# Altium schematic sheet 0146_MTG HOLES AND LABE.SchDoc
size 848 x 558 mm
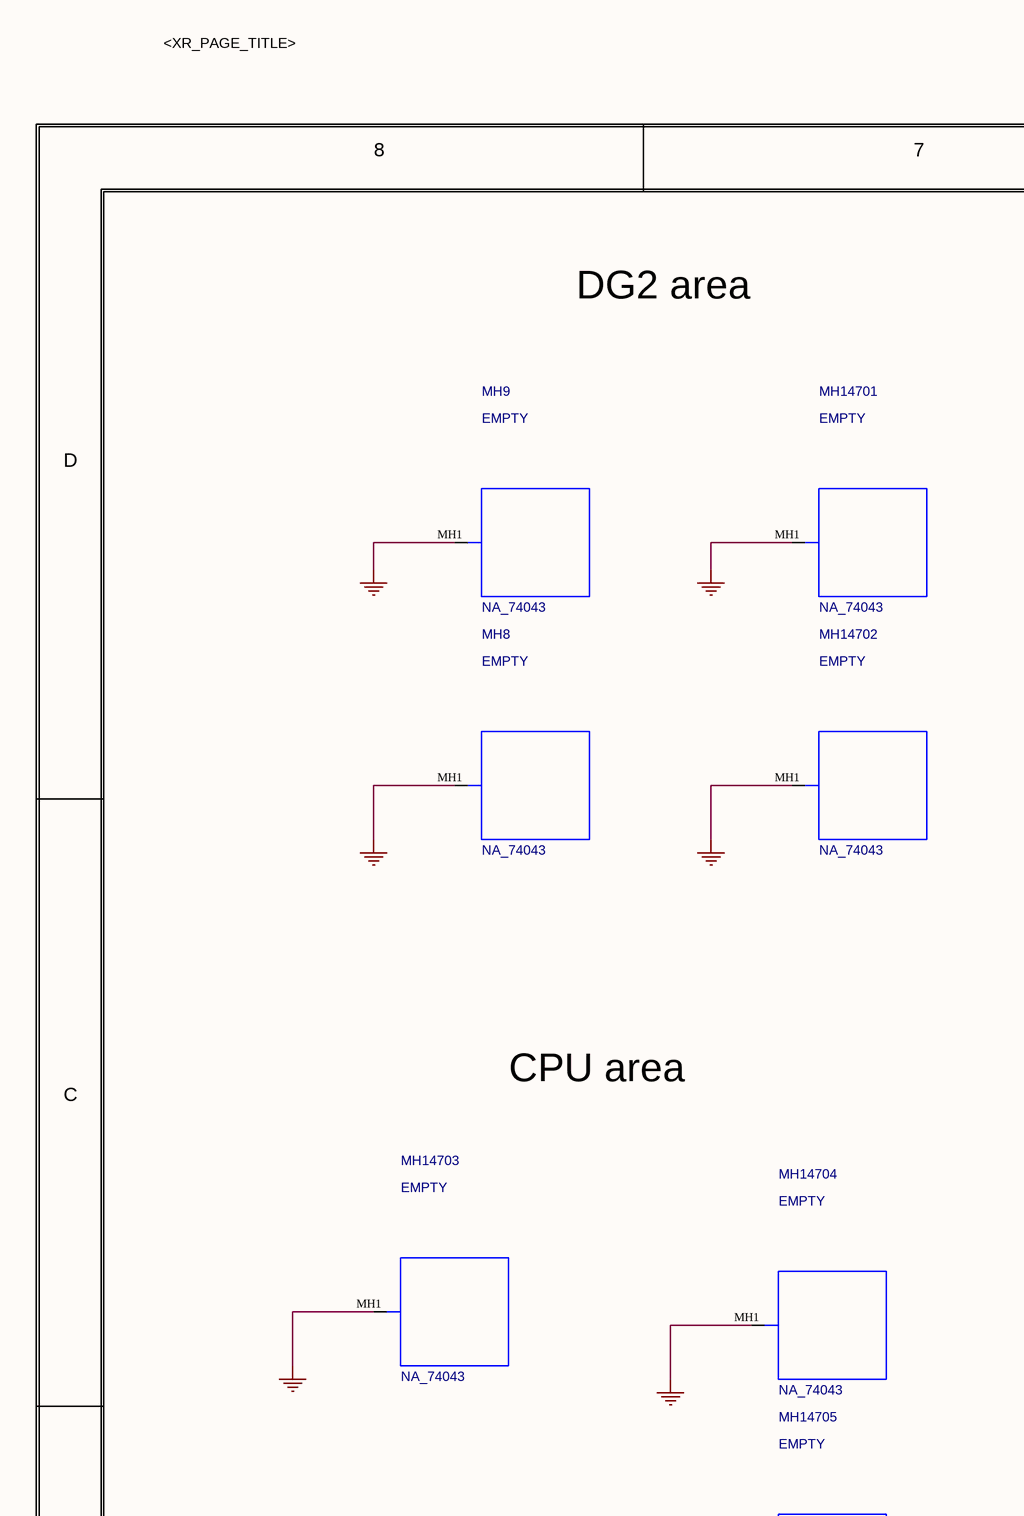
[diagram p0: 0146_MTG HOLES AND LABE.SchDoc, top left]
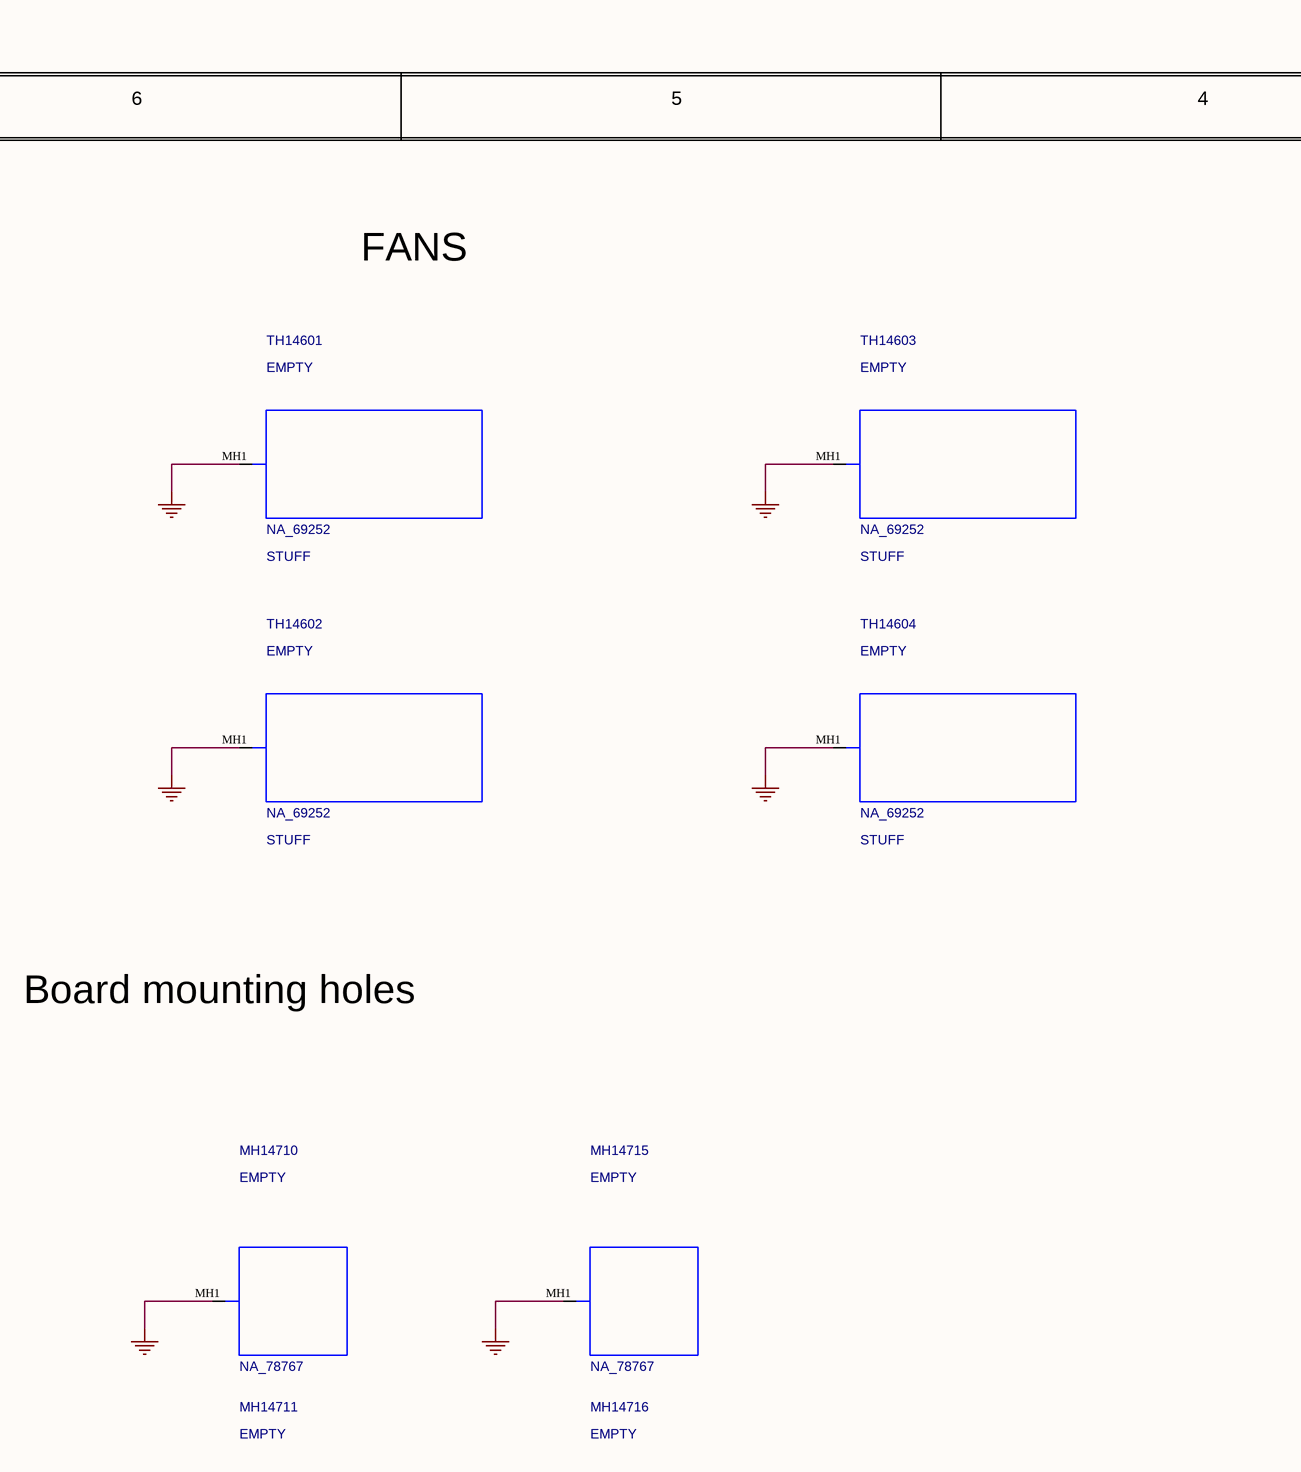
[diagram p1: 0146_MTG HOLES AND LABE.SchDoc, top middle]
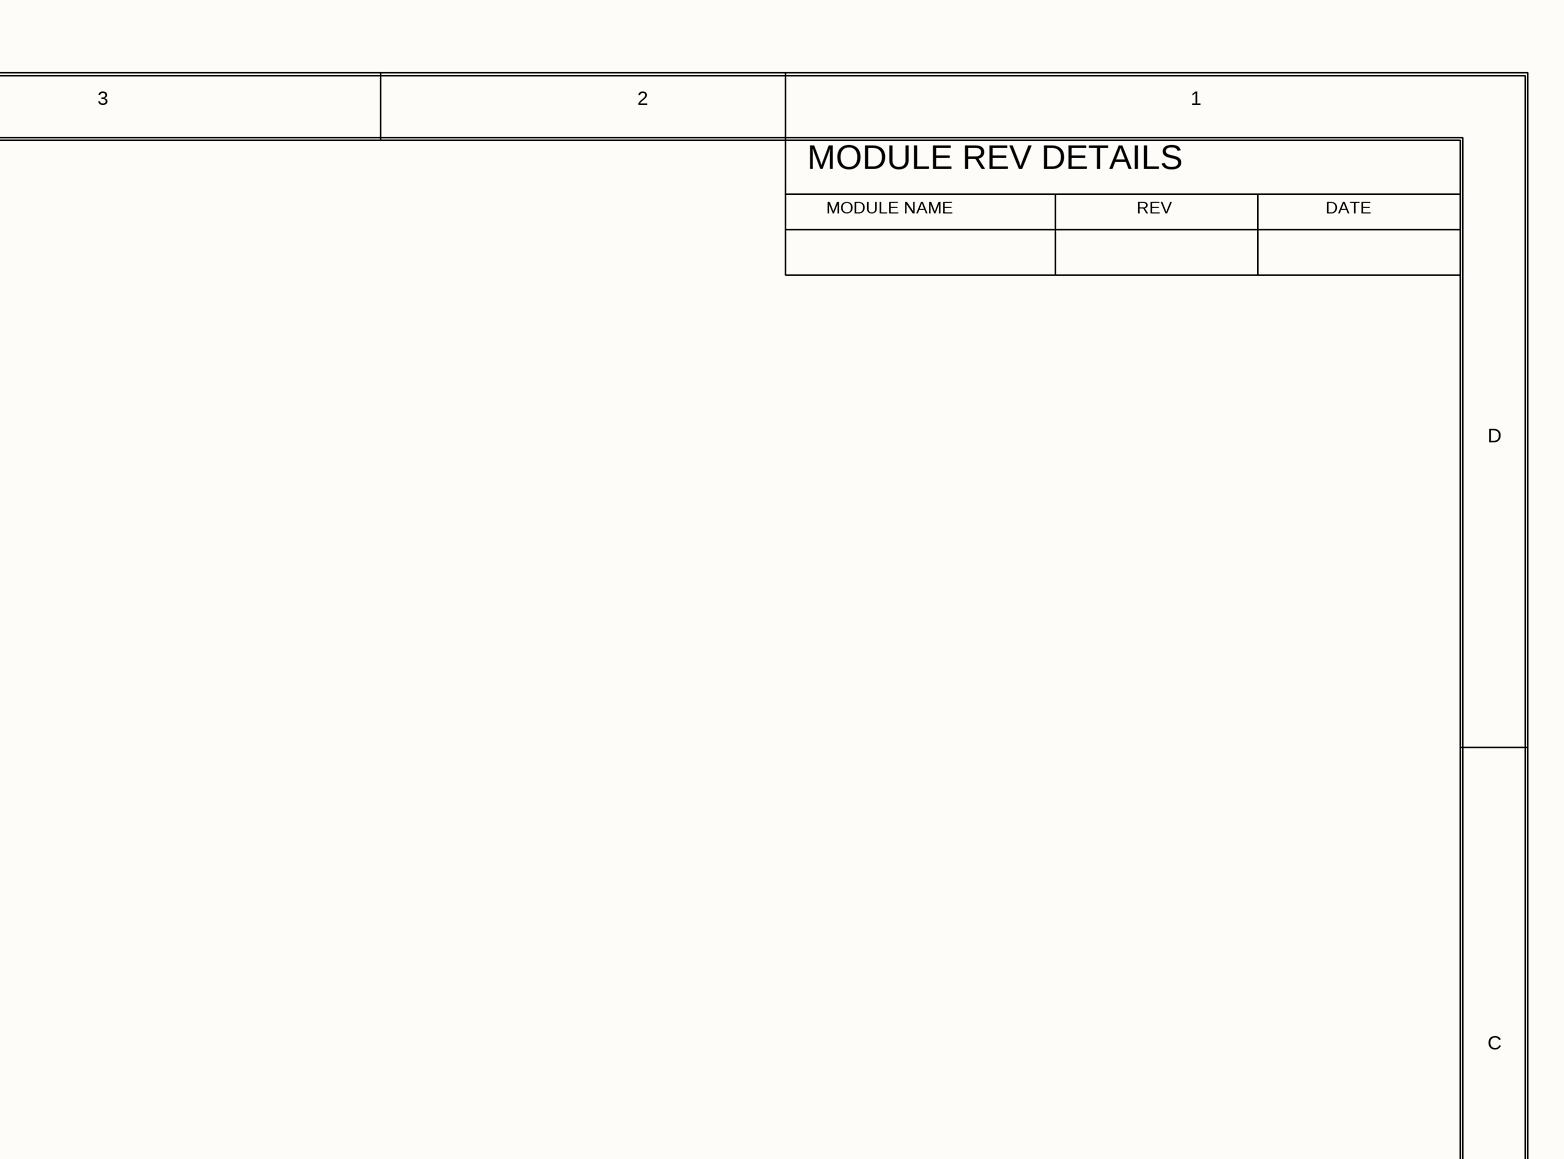
[diagram p2: 0146_MTG HOLES AND LABE.SchDoc, top right]
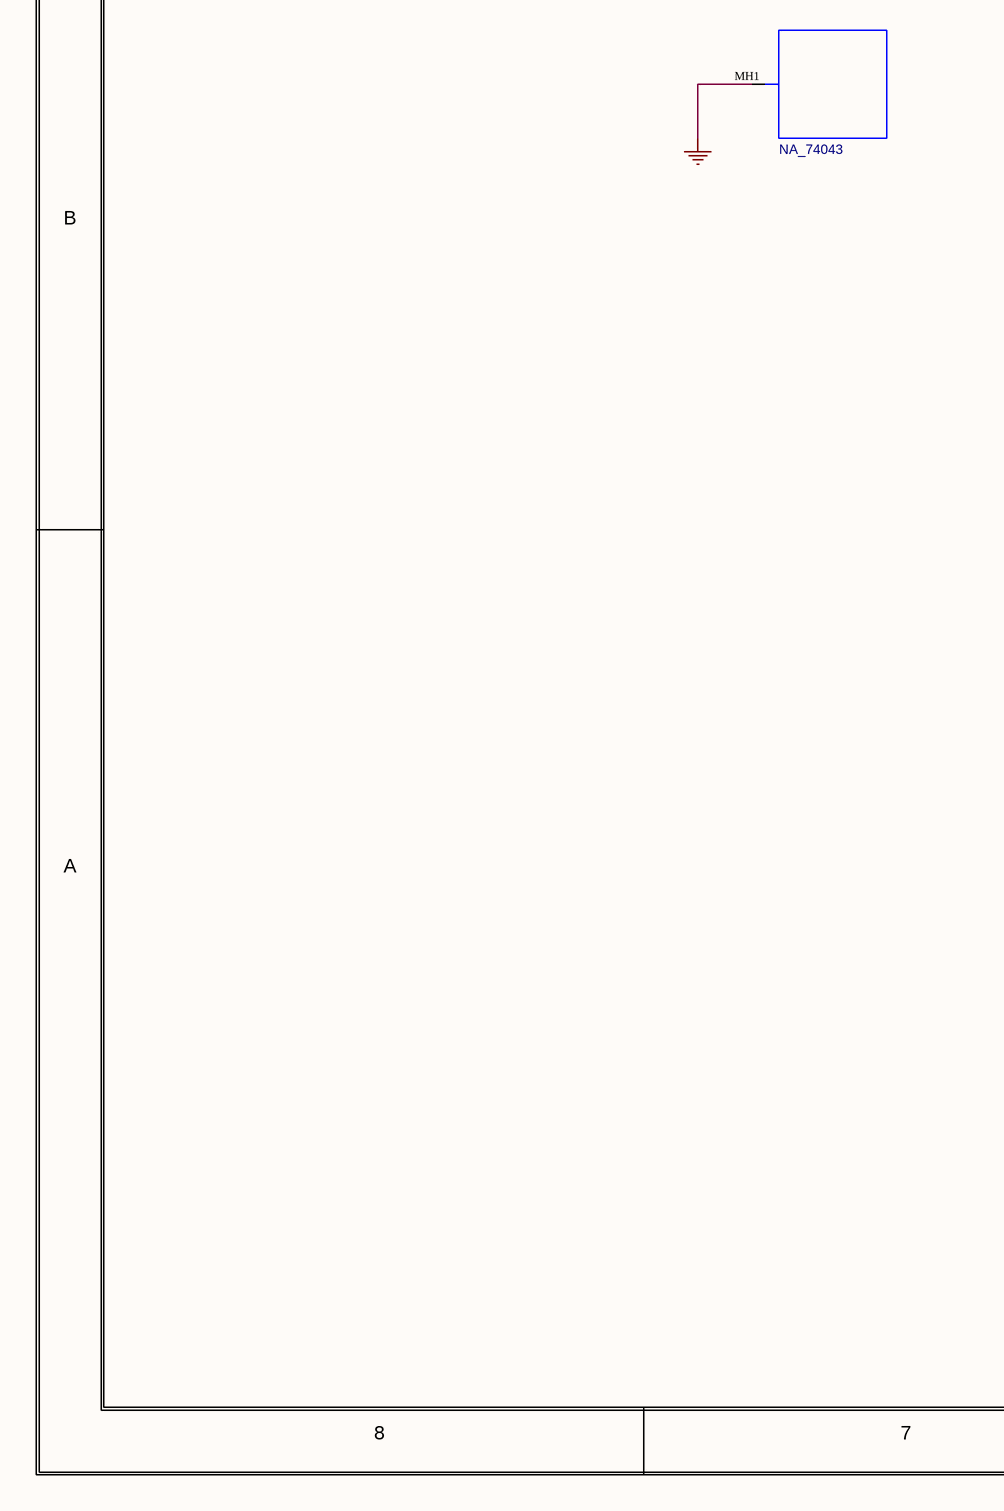
[diagram p3: 0146_MTG HOLES AND LABE.SchDoc, bottom left]
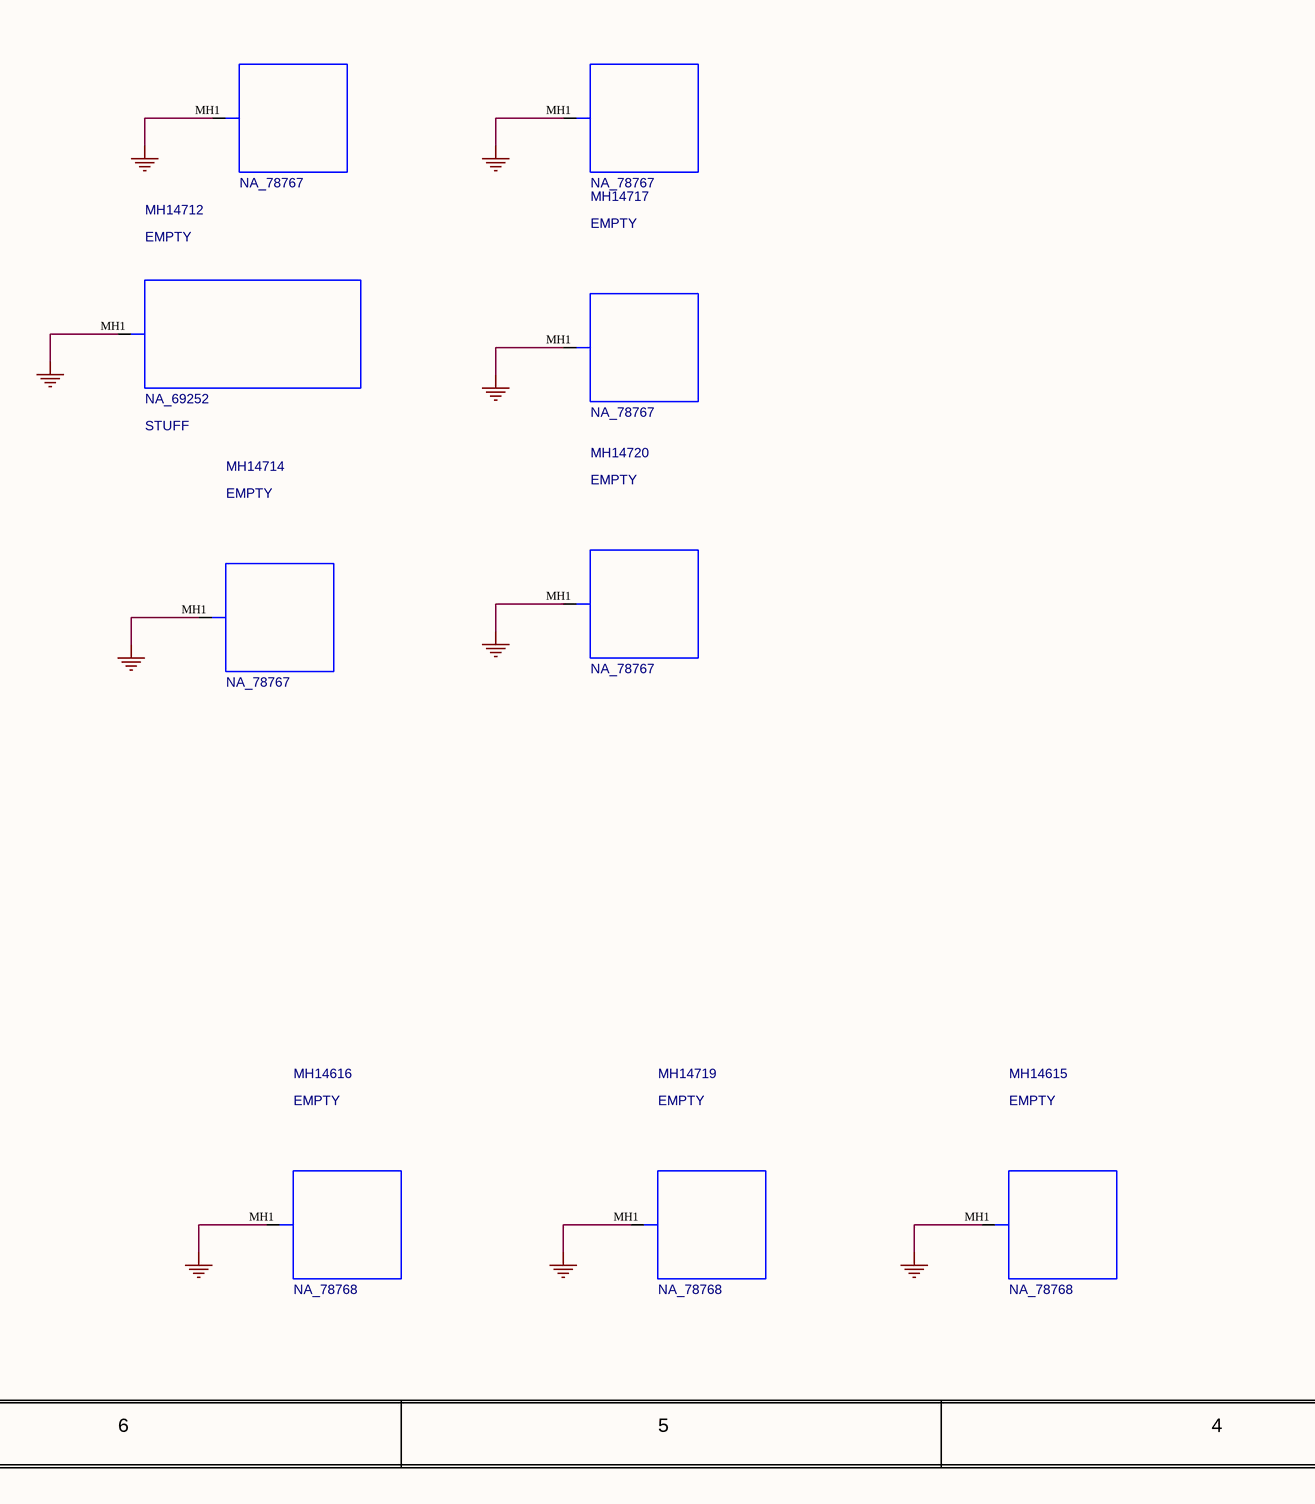
[diagram p4: 0146_MTG HOLES AND LABE.SchDoc, bottom middle]
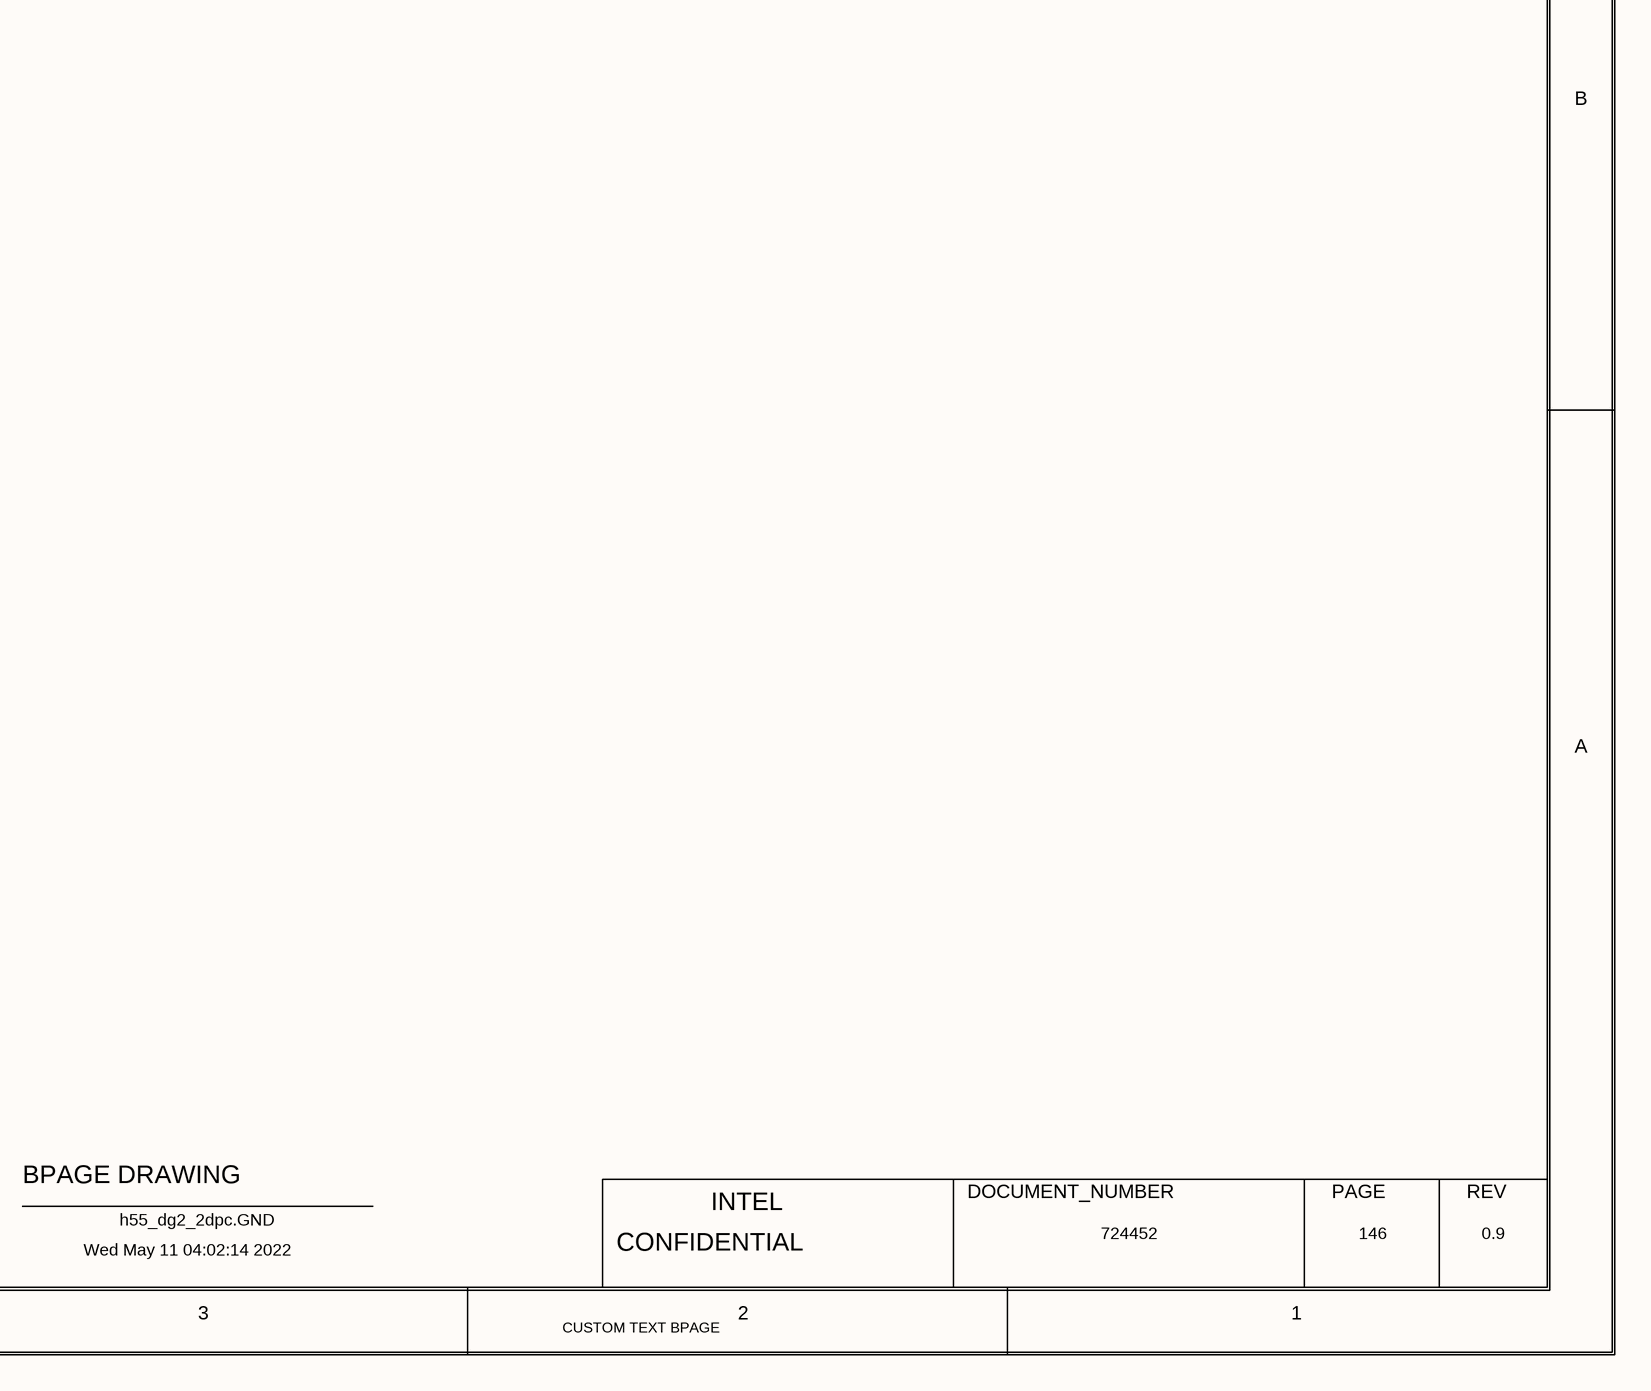
[diagram p5: 0146_MTG HOLES AND LABE.SchDoc, bottom right]

## Parts
MH8  MATERIAL: EMPTY  PART_NUMBER: NA_74043  [CMTG_6500P4200_MA]  (hidden comment: C_MTG_HOLE)
MH9  MATERIAL: EMPTY  PART_NUMBER: NA_74043  [CMTG_6500P4200_MA]  (hidden comment: C_MTG_HOLE)
MH14615  MATERIAL: EMPTY  PART_NUMBER: NA_78768  [CMTG_8000P2400_MA]  (hidden comment: C_MTG_HOLE)
MH14616  MATERIAL: EMPTY  PART_NUMBER: NA_78768  [CMTG_8000P2400_MA]  (hidden comment: C_MTG_HOLE)
MH14701  MATERIAL: EMPTY  PART_NUMBER: NA_74043  [CMTG_6500P4200_MA]  (hidden comment: C_MTG_HOLE)
MH14702  MATERIAL: EMPTY  PART_NUMBER: NA_74043  [CMTG_6500P4200_MA]  (hidden comment: C_MTG_HOLE)
MH14703  MATERIAL: EMPTY  PART_NUMBER: NA_74043  [CMTG_6500P4200_MA]  (hidden comment: C_MTG_HOLE)
MH14704  MATERIAL: EMPTY  PART_NUMBER: NA_74043  [CMTG_6500P4200_MA]  (hidden comment: C_MTG_HOLE)
MH14705  MATERIAL: EMPTY  PART_NUMBER: NA_74043  [CMTG_6500P4200_MA]  (hidden comment: C_MTG_HOLE)
MH14710  MATERIAL: EMPTY  PART_NUMBER: NA_78767  [CMTG_6000P2400_MA]  (hidden comment: C_MTG_HOLE)
MH14711  MATERIAL: EMPTY  PART_NUMBER: NA_78767  [CMTG_6000P2400_MA]  (hidden comment: C_MTG_HOLE)
MH14712  BOM_USE: STUFF  MATERIAL: EMPTY  PART_NUMBER: NA_69252  [MTG_5000P3500_MA]  (hidden comment: MTG_HOLE_2)
MH14714  MATERIAL: EMPTY  PART_NUMBER: NA_78767  [CMTG_6000P2400_MA]  (hidden comment: C_MTG_HOLE)
MH14715  MATERIAL: EMPTY  PART_NUMBER: NA_78767  [CMTG_6000P2400_MA]  (hidden comment: C_MTG_HOLE)
MH14716  MATERIAL: EMPTY  PART_NUMBER: NA_78767  [CMTG_6000P2400_MA]  (hidden comment: C_MTG_HOLE)
MH14717  MATERIAL: EMPTY  PART_NUMBER: NA_78767  [CMTG_6000P2400_MA]  (hidden comment: C_MTG_HOLE)
MH14719  MATERIAL: EMPTY  PART_NUMBER: NA_78768  [CMTG_8000P2400_MA]  (hidden comment: C_MTG_HOLE)
MH14720  MATERIAL: EMPTY  PART_NUMBER: NA_78767  [CMTG_6000P2400_MA]  (hidden comment: C_MTG_HOLE)
TH14601  BOM_USE: STUFF  MATERIAL: EMPTY  PART_NUMBER: NA_69252  [MTG_5000P3500_MA]  (hidden comment: MTG_HOLE_2)
TH14602  BOM_USE: STUFF  MATERIAL: EMPTY  PART_NUMBER: NA_69252  [MTG_5000P3500_MA]  (hidden comment: MTG_HOLE_2)
TH14603  BOM_USE: STUFF  MATERIAL: EMPTY  PART_NUMBER: NA_69252  [MTG_5000P3500_MA]  (hidden comment: MTG_HOLE_2)
TH14604  BOM_USE: STUFF  MATERIAL: EMPTY  PART_NUMBER: NA_69252  [MTG_5000P3500_MA]  (hidden comment: MTG_HOLE_2)

## Nets
GND: MH8.MH1 MH9.MH1 MH14615.MH1 MH14616.MH1 MH14701.MH1 MH14702.MH1 MH14703.MH1 MH14704.MH1 MH14705.MH1 MH14710.MH1 MH14711.MH1 MH14712.MH1 MH14714.MH1 MH14715.MH1 MH14716.MH1 MH14717.MH1 MH14719.MH1 MH14720.MH1 TH14601.MH1 TH14602.MH1 TH14603.MH1 TH14604.MH1

## Notes on the sheet
- <XR_PAGE_TITLE>
- 8
- 7
- 6
- 5
- 4
- 3
- 2
- 1
- MODULE REV DETAILS
- DG2 area
- FANS
- MODULE NAME
- REV
- DATE
- D
- Board mounting holes
- C
- CPU area
- B
- A
- BPAGE DRAWING
- INTEL
- DOCUMENT_NUMBER
- PAGE
- Wed May 11 04:02:14 2022
- h55_dg2_2dpc.GND
- CONFIDENTIAL
- 724452
- 146
- 0.9
- CUSTOM TEXT BPAGE

## Library data of the parts
MH8 = C_MTG_HOLE: CDS_PHYS_PART_NAME: C_MTG_HOLE_TH-NA_74043,EMPTY,MTG,TK0,GENERIC; CDS_LMAN_SYM_OUTLINE: -100,100,100,-100; FP_TECH: TK0; IP: GENERIC; PACK_TYPE: TH; ROOM: NONE; OriginalSymbolOrigin: (-125,100); XY: (-7875,3850); VER: 1; ROT: 0; PHYS_PAGE: 146; LOCATION: MH8; DRAWING: @RVP1_ADL_SB_ADP_S_DDR5_SODIMM_2DPC_LIB.H55_DG2_2DPC(SCH_1):PAGE515; CDS_LIB: local; VARIANT: ?; PCB Footprint: CMTG_6500P4200_MA; CHIPS_PART_NAME: C_MTG_HOLE; CDS_PART_NAME: C_MTG_HOLE_TH-NA_74043,EMPTY,MTG,TK0,GENERIC; CDS_LOCATION: MH8
MH9 = C_MTG_HOLE: CDS_PHYS_PART_NAME: C_MTG_HOLE_TH-NA_74043,EMPTY,MTG,TK0,GENERIC; CDS_LMAN_SYM_OUTLINE: -100,100,100,-100; FP_TECH: TK0; IP: GENERIC; PACK_TYPE: TH; ROOM: NONE; OriginalSymbolOrigin: (-125,100); XY: (-7875,4300); VER: 1; ROT: 0; PHYS_PAGE: 146; LOCATION: MH9; DRAWING: @RVP1_ADL_SB_ADP_S_DDR5_SODIMM_2DPC_LIB.H55_DG2_2DPC(SCH_1):PAGE515; CDS_LIB: local; VARIANT: ?; PCB Footprint: CMTG_6500P4200_MA; CHIPS_PART_NAME: C_MTG_HOLE; CDS_PART_NAME: C_MTG_HOLE_TH-NA_74043,EMPTY,MTG,TK0,GENERIC; CDS_LOCATION: MH9
MH14615 = C_MTG_HOLE: CDS_PHYS_PART_NAME: C_MTG_HOLE_TH-NA_78768,EMPTY,MTG,TK0,GENERIC; CDS_LMAN_SYM_OUTLINE: -100,100,100,-100; FP_TECH: TK0; IP: GENERIC; PACK_TYPE: TH; ROOM: NONE; OriginalSymbolOrigin: (-125,100); XY: (-4450,275); VER: 1; ROT: 0; PHYS_PAGE: 146; LOCATION: MH14615; DRAWING: @RVP1_ADL_SB_ADP_S_DDR5_SODIMM_2DPC_LIB.H55_DG2_2DPC(SCH_1):PAGE515; CDS_LIB: local; VARIANT: ?; PCB Footprint: CMTG_8000P2400_MA; CHIPS_PART_NAME: C_MTG_HOLE; CDS_PART_NAME: C_MTG_HOLE_TH-NA_78768,EMPTY,MTG,TK0,GENERIC; CDS_LOCATION: MH14615
MH14616 = C_MTG_HOLE: CDS_PHYS_PART_NAME: C_MTG_HOLE_TH-NA_78768,EMPTY,MTG,TK0,GENERIC; CDS_LMAN_SYM_OUTLINE: -100,100,100,-100; FP_TECH: TK0; IP: GENERIC; PACK_TYPE: TH; ROOM: NONE; OriginalSymbolOrigin: (-125,100); XY: (-5775,275); VER: 1; ROT: 0; PHYS_PAGE: 146; LOCATION: MH14616; DRAWING: @RVP1_ADL_SB_ADP_S_DDR5_SODIMM_2DPC_LIB.H55_DG2_2DPC(SCH_1):PAGE515; CDS_LIB: local; VARIANT: ?; PCB Footprint: CMTG_8000P2400_MA; CHIPS_PART_NAME: C_MTG_HOLE; CDS_PART_NAME: C_MTG_HOLE_TH-NA_78768,EMPTY,MTG,TK0,GENERIC; CDS_LOCATION: MH14616
MH14701 = C_MTG_HOLE: CDS_PHYS_PART_NAME: C_MTG_HOLE_TH-NA_74043,EMPTY,MTG,TK0,GENERIC; CDS_LMAN_SYM_OUTLINE: -100,100,100,-100; FP_TECH: TK0; IP: GENERIC; PACK_TYPE: TH; ROOM: NONE; OriginalSymbolOrigin: (-125,100); XY: (-7250,4300); VER: 1; ROT: 0; PHYS_PAGE: 146; LOCATION: MH14701; DRAWING: @RVP1_ADL_SB_ADP_S_DDR5_SODIMM_2DPC_LIB.H55_DG2_2DPC(SCH_1):PAGE515; CDS_LIB: local; VARIANT: ?; PCB Footprint: CMTG_6500P4200_MA; CHIPS_PART_NAME: C_MTG_HOLE; CDS_PART_NAME: C_MTG_HOLE_TH-NA_74043,EMPTY,MTG,TK0,GENERIC; CDS_LOCATION: MH14701
MH14702 = C_MTG_HOLE: CDS_PHYS_PART_NAME: C_MTG_HOLE_TH-NA_74043,EMPTY,MTG,TK0,GENERIC; CDS_LMAN_SYM_OUTLINE: -100,100,100,-100; FP_TECH: TK0; IP: GENERIC; PACK_TYPE: TH; ROOM: NONE; OriginalSymbolOrigin: (-125,100); XY: (-7250,3850); VER: 1; ROT: 0; PHYS_PAGE: 146; LOCATION: MH14702; DRAWING: @RVP1_ADL_SB_ADP_S_DDR5_SODIMM_2DPC_LIB.H55_DG2_2DPC(SCH_1):PAGE515; CDS_LIB: local; VARIANT: ?; PCB Footprint: CMTG_6500P4200_MA; CHIPS_PART_NAME: C_MTG_HOLE; CDS_PART_NAME: C_MTG_HOLE_TH-NA_74043,EMPTY,MTG,TK0,GENERIC; CDS_LOCATION: MH14702
MH14703 = C_MTG_HOLE: CDS_PHYS_PART_NAME: C_MTG_HOLE_TH-NA_74043,EMPTY,MTG,TK0,GENERIC; CDS_LMAN_SYM_OUTLINE: -100,100,100,-100; FP_TECH: TK0; IP: GENERIC; PACK_TYPE: TH; ROOM: NONE; OriginalSymbolOrigin: (-125,100); XY: (-8025,2875); VER: 1; ROT: 0; PHYS_PAGE: 146; LOCATION: MH14703; DRAWING: @RVP1_ADL_SB_ADP_S_DDR5_SODIMM_2DPC_LIB.H55_DG2_2DPC(SCH_1):PAGE515; CDS_LIB: local; VARIANT: ?; PCB Footprint: CMTG_6500P4200_MA; CHIPS_PART_NAME: C_MTG_HOLE; CDS_PART_NAME: C_MTG_HOLE_TH-NA_74043,EMPTY,MTG,TK0,GENERIC; CDS_LOCATION: MH14703
MH14704 = C_MTG_HOLE: CDS_PHYS_PART_NAME: C_MTG_HOLE_TH-NA_74043,EMPTY,MTG,TK0,GENERIC; CDS_LMAN_SYM_OUTLINE: -100,100,100,-100; FP_TECH: TK0; IP: GENERIC; PACK_TYPE: TH; ROOM: NONE; OriginalSymbolOrigin: (-125,100); XY: (-7325,2850); VER: 1; ROT: 0; PHYS_PAGE: 146; LOCATION: MH14704; DRAWING: @RVP1_ADL_SB_ADP_S_DDR5_SODIMM_2DPC_LIB.H55_DG2_2DPC(SCH_1):PAGE515; CDS_LIB: local; VARIANT: ?; PCB Footprint: CMTG_6500P4200_MA; CHIPS_PART_NAME: C_MTG_HOLE; CDS_PART_NAME: C_MTG_HOLE_TH-NA_74043,EMPTY,MTG,TK0,GENERIC; CDS_LOCATION: MH14704
MH14705 = C_MTG_HOLE: CDS_PHYS_PART_NAME: C_MTG_HOLE_TH-NA_74043,EMPTY,MTG,TK0,GENERIC; CDS_LMAN_SYM_OUTLINE: -100,100,100,-100; FP_TECH: TK0; IP: GENERIC; PACK_TYPE: TH; ROOM: NONE; OriginalSymbolOrigin: (-125,100); XY: (-7325,2400); VER: 1; ROT: 0; PHYS_PAGE: 146; LOCATION: MH14705; DRAWING: @RVP1_ADL_SB_ADP_S_DDR5_SODIMM_2DPC_LIB.H55_DG2_2DPC(SCH_1):PAGE515; CDS_LIB: local; VARIANT: ?; PCB Footprint: CMTG_6500P4200_MA; CHIPS_PART_NAME: C_MTG_HOLE; CDS_PART_NAME: C_MTG_HOLE_TH-NA_74043,EMPTY,MTG,TK0,GENERIC; CDS_LOCATION: MH14705
MH14710 = C_MTG_HOLE: CDS_PHYS_PART_NAME: C_MTG_HOLE_TH-NA_78767,EMPTY,MTG,TK0,GENERIC; CDS_LMAN_SYM_OUTLINE: -100,100,100,-100; FP_TECH: TK0; IP: GENERIC; PACK_TYPE: TH; ROOM: NONE; OriginalSymbolOrigin: (-125,100); XY: (-5875,2800); VER: 1; ROT: 0; PHYS_PAGE: 146; LOCATION: MH14710; DRAWING: @RVP1_ADL_SB_ADP_S_DDR5_SODIMM_2DPC_LIB.H55_DG2_2DPC(SCH_1):PAGE515; CDS_LIB: local; VARIANT: ?; PCB Footprint: CMTG_6000P2400_MA; CHIPS_PART_NAME: C_MTG_HOLE; CDS_PART_NAME: C_MTG_HOLE_TH-NA_78767,EMPTY,MTG,TK0,GENERIC; CDS_LOCATION: MH14710
MH14711 = C_MTG_HOLE: CDS_PHYS_PART_NAME: C_MTG_HOLE_TH-NA_78767,EMPTY,MTG,TK0,GENERIC; CDS_LMAN_SYM_OUTLINE: -100,100,100,-100; FP_TECH: TK0; IP: GENERIC; PACK_TYPE: TH; ROOM: NONE; OriginalSymbolOrigin: (-125,100); XY: (-5875,2325); VER: 1; ROT: 0; PHYS_PAGE: 146; LOCATION: MH14711; DRAWING: @RVP1_ADL_SB_ADP_S_DDR5_SODIMM_2DPC_LIB.H55_DG2_2DPC(SCH_1):PAGE515; CDS_LIB: local; VARIANT: ?; PCB Footprint: CMTG_6000P2400_MA; CHIPS_PART_NAME: C_MTG_HOLE; CDS_PART_NAME: C_MTG_HOLE_TH-NA_78767,EMPTY,MTG,TK0,GENERIC; CDS_LOCATION: MH14711
MH14712 = MTG_HOLE_2: CDS_PHYS_PART_NAME: MTG_HOLE_2_TH-NA_69252,EMPTY,MTG_HOLE,TK0,GENERIC; CDS_LMAN_SYM_OUTLINE: -200,100,200,-100; FP_TECH: TK0; IP: GENERIC; PACK_TYPE: TH; ROOM: NONE; OriginalSymbolOrigin: (-225,100); XY: (-5950,1925); VER: 1; ROT: 0; PHYS_PAGE: 146; LOCATION: MH14712; DRAWING: @RVP1_ADL_SB_ADP_S_DDR5_SODIMM_2DPC_LIB.H55_DG2_2DPC(SCH_1):PAGE515; CDS_LIB: local; VARIANT: ?; PCB Footprint: MTG_5000P3500_MA; CHIPS_PART_NAME: MTG_HOLE_2; CDS_PART_NAME: MTG_HOLE_2_TH-NA_69252,EMPTY,MTG_HOLE,TK0,GENERIC; CDS_LOCATION: MH14712
MH14714 = C_MTG_HOLE: CDS_PHYS_PART_NAME: C_MTG_HOLE_TH-NA_78767,EMPTY,MTG,TK0,GENERIC; CDS_LMAN_SYM_OUTLINE: -100,100,100,-100; FP_TECH: TK0; IP: GENERIC; PACK_TYPE: TH; ROOM: NONE; OriginalSymbolOrigin: (-125,100); XY: (-5900,1400); VER: 1; ROT: 0; PHYS_PAGE: 146; LOCATION: MH14714; DRAWING: @RVP1_ADL_SB_ADP_S_DDR5_SODIMM_2DPC_LIB.H55_DG2_2DPC(SCH_1):PAGE515; CDS_LIB: local; VARIANT: ?; PCB Footprint: CMTG_6000P2400_MA; CHIPS_PART_NAME: C_MTG_HOLE; CDS_PART_NAME: C_MTG_HOLE_TH-NA_78767,EMPTY,MTG,TK0,GENERIC; CDS_LOCATION: MH14714
MH14715 = C_MTG_HOLE: CDS_PHYS_PART_NAME: C_MTG_HOLE_TH-NA_78767,EMPTY,MTG,TK0,GENERIC; CDS_LMAN_SYM_OUTLINE: -100,100,100,-100; FP_TECH: TK0; IP: GENERIC; PACK_TYPE: TH; ROOM: NONE; OriginalSymbolOrigin: (-125,100); XY: (-5225,2800); VER: 1; ROT: 0; PHYS_PAGE: 146; LOCATION: MH14715; DRAWING: @RVP1_ADL_SB_ADP_S_DDR5_SODIMM_2DPC_LIB.H55_DG2_2DPC(SCH_1):PAGE515; CDS_LIB: local; VARIANT: ?; PCB Footprint: CMTG_6000P2400_MA; CHIPS_PART_NAME: C_MTG_HOLE; CDS_PART_NAME: C_MTG_HOLE_TH-NA_78767,EMPTY,MTG,TK0,GENERIC; CDS_LOCATION: MH14715
MH14716 = C_MTG_HOLE: CDS_PHYS_PART_NAME: C_MTG_HOLE_TH-NA_78767,EMPTY,MTG,TK0,GENERIC; CDS_LMAN_SYM_OUTLINE: -100,100,100,-100; FP_TECH: TK0; IP: GENERIC; PACK_TYPE: TH; ROOM: NONE; OriginalSymbolOrigin: (-125,100); XY: (-5225,2325); VER: 1; ROT: 0; PHYS_PAGE: 146; LOCATION: MH14716; DRAWING: @RVP1_ADL_SB_ADP_S_DDR5_SODIMM_2DPC_LIB.H55_DG2_2DPC(SCH_1):PAGE515; CDS_LIB: local; VARIANT: ?; PCB Footprint: CMTG_6000P2400_MA; CHIPS_PART_NAME: C_MTG_HOLE; CDS_PART_NAME: C_MTG_HOLE_TH-NA_78767,EMPTY,MTG,TK0,GENERIC; CDS_LOCATION: MH14716
MH14717 = C_MTG_HOLE: CDS_PHYS_PART_NAME: C_MTG_HOLE_TH-NA_78767,EMPTY,MTG,TK0,GENERIC; CDS_LMAN_SYM_OUTLINE: -100,100,100,-100; FP_TECH: TK0; IP: GENERIC; PACK_TYPE: TH; ROOM: NONE; OriginalSymbolOrigin: (-125,100); XY: (-5225,1900); VER: 1; ROT: 0; PHYS_PAGE: 146; LOCATION: MH14717; DRAWING: @RVP1_ADL_SB_ADP_S_DDR5_SODIMM_2DPC_LIB.H55_DG2_2DPC(SCH_1):PAGE515; CDS_LIB: local; VARIANT: ?; PCB Footprint: CMTG_6000P2400_MA; CHIPS_PART_NAME: C_MTG_HOLE; CDS_PART_NAME: C_MTG_HOLE_TH-NA_78767,EMPTY,MTG,TK0,GENERIC; CDS_LOCATION: MH14717
MH14719 = C_MTG_HOLE: CDS_PHYS_PART_NAME: C_MTG_HOLE_TH-NA_78768,EMPTY,MTG,TK0,GENERIC; CDS_LMAN_SYM_OUTLINE: -100,100,100,-100; FP_TECH: TK0; IP: GENERIC; PACK_TYPE: TH; ROOM: NONE; OriginalSymbolOrigin: (-125,100); XY: (-5100,275); VER: 1; ROT: 0; PHYS_PAGE: 146; LOCATION: MH14719; DRAWING: @RVP1_ADL_SB_ADP_S_DDR5_SODIMM_2DPC_LIB.H55_DG2_2DPC(SCH_1):PAGE515; CDS_LIB: local; VARIANT: ?; PCB Footprint: CMTG_8000P2400_MA; CHIPS_PART_NAME: C_MTG_HOLE; CDS_PART_NAME: C_MTG_HOLE_TH-NA_78768,EMPTY,MTG,TK0,GENERIC; CDS_LOCATION: MH14719
MH14720 = C_MTG_HOLE: CDS_PHYS_PART_NAME: C_MTG_HOLE_TH-NA_78767,EMPTY,MTG,TK0,GENERIC; CDS_LMAN_SYM_OUTLINE: -100,100,100,-100; FP_TECH: TK0; IP: GENERIC; PACK_TYPE: TH; ROOM: NONE; OriginalSymbolOrigin: (-125,100); XY: (-5225,1425); VER: 1; ROT: 0; PHYS_PAGE: 146; LOCATION: MH14720; DRAWING: @RVP1_ADL_SB_ADP_S_DDR5_SODIMM_2DPC_LIB.H55_DG2_2DPC(SCH_1):PAGE515; CDS_LIB: local; VARIANT: ?; PCB Footprint: CMTG_6000P2400_MA; CHIPS_PART_NAME: C_MTG_HOLE; CDS_PART_NAME: C_MTG_HOLE_TH-NA_78767,EMPTY,MTG,TK0,GENERIC; CDS_LOCATION: MH14720
TH14601 = MTG_HOLE_2: CDS_PHYS_PART_NAME: MTG_HOLE_2_TH-NA_69252,EMPTY,MTG_HOLE,TK0,GENERIC; CDS_LMAN_SYM_OUTLINE: -200,100,200,-100; FP_TECH: TK0; IP: GENERIC; PACK_TYPE: TH; ROOM: NONE; OriginalSymbolOrigin: (-225,100); XY: (-5725,4350); VER: 1; ROT: 0; PHYS_PAGE: 146; LOCATION: TH14601; DRAWING: @RVP1_ADL_SB_ADP_S_DDR5_SODIMM_2DPC_LIB.H55_DG2_2DPC(SCH_1):PAGE515; CDS_LIB: local; VARIANT: ?; PCB Footprint: MTG_5000P3500_MA; CHIPS_PART_NAME: MTG_HOLE_2; CDS_PART_NAME: MTG_HOLE_2_TH-NA_69252,EMPTY,MTG_HOLE,TK0,GENERIC; CDS_LOCATION: TH14601
TH14602 = MTG_HOLE_2: CDS_PHYS_PART_NAME: MTG_HOLE_2_TH-NA_69252,EMPTY,MTG_HOLE,TK0,GENERIC; CDS_LMAN_SYM_OUTLINE: -200,100,200,-100; FP_TECH: TK0; IP: GENERIC; PACK_TYPE: TH; ROOM: NONE; OriginalSymbolOrigin: (-225,100); XY: (-5725,3825); VER: 1; ROT: 0; PHYS_PAGE: 146; LOCATION: TH14602; DRAWING: @RVP1_ADL_SB_ADP_S_DDR5_SODIMM_2DPC_LIB.H55_DG2_2DPC(SCH_1):PAGE515; CDS_LIB: local; VARIANT: ?; PCB Footprint: MTG_5000P3500_MA; CHIPS_PART_NAME: MTG_HOLE_2; CDS_PART_NAME: MTG_HOLE_2_TH-NA_69252,EMPTY,MTG_HOLE,TK0,GENERIC; CDS_LOCATION: TH14602
TH14603 = MTG_HOLE_2: CDS_PHYS_PART_NAME: MTG_HOLE_2_TH-NA_69252,EMPTY,MTG_HOLE,TK0,GENERIC; CDS_LMAN_SYM_OUTLINE: -200,100,200,-100; FP_TECH: TK0; IP: GENERIC; PACK_TYPE: TH; ROOM: NONE; OriginalSymbolOrigin: (-225,100); XY: (-4625,4350); VER: 1; ROT: 0; PHYS_PAGE: 146; LOCATION: TH14603; DRAWING: @RVP1_ADL_SB_ADP_S_DDR5_SODIMM_2DPC_LIB.H55_DG2_2DPC(SCH_1):PAGE515; CDS_LIB: local; VARIANT: ?; PCB Footprint: MTG_5000P3500_MA; CHIPS_PART_NAME: MTG_HOLE_2; CDS_PART_NAME: MTG_HOLE_2_TH-NA_69252,EMPTY,MTG_HOLE,TK0,GENERIC; CDS_LOCATION: TH14603
TH14604 = MTG_HOLE_2: CDS_PHYS_PART_NAME: MTG_HOLE_2_TH-NA_69252,EMPTY,MTG_HOLE,TK0,GENERIC; CDS_LMAN_SYM_OUTLINE: -200,100,200,-100; FP_TECH: TK0; IP: GENERIC; PACK_TYPE: TH; ROOM: NONE; OriginalSymbolOrigin: (-225,100); XY: (-4625,3825); VER: 1; ROT: 0; PHYS_PAGE: 146; LOCATION: TH14604; DRAWING: @RVP1_ADL_SB_ADP_S_DDR5_SODIMM_2DPC_LIB.H55_DG2_2DPC(SCH_1):PAGE515; CDS_LIB: local; VARIANT: ?; PCB Footprint: MTG_5000P3500_MA; CHIPS_PART_NAME: MTG_HOLE_2; CDS_PART_NAME: MTG_HOLE_2_TH-NA_69252,EMPTY,MTG_HOLE,TK0,GENERIC; CDS_LOCATION: TH14604